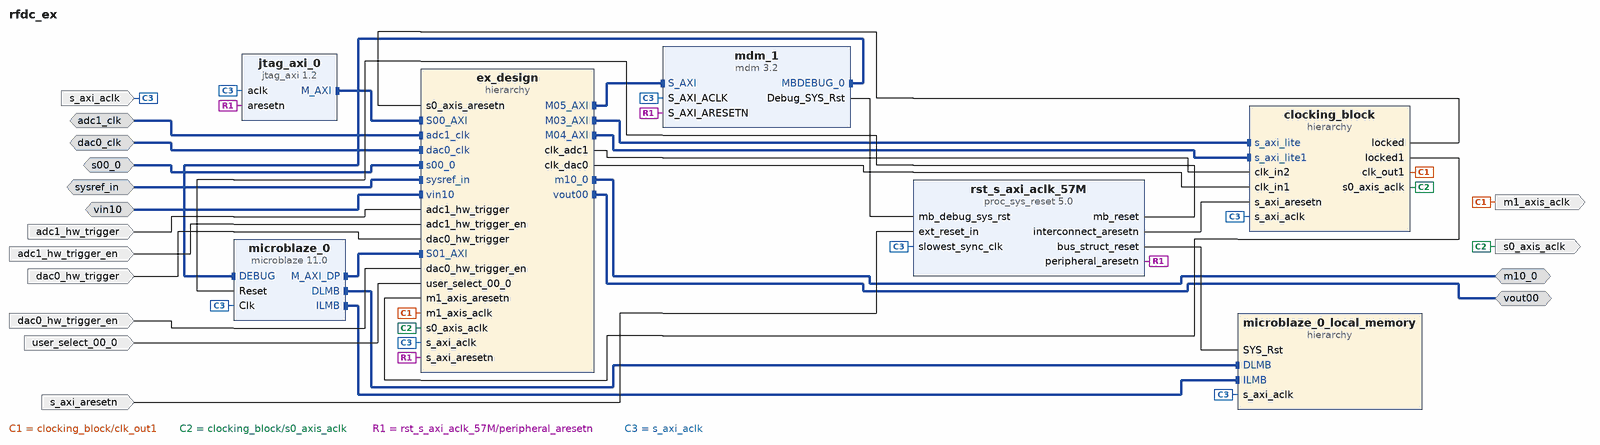
[diagram p0: block diagram of the top level]
# Vivado block design rfdc_ex, xczu67dr-fsve1156-2-i, Vivado 2023.2
create_bd_design rfdc_ex

create_bd_intf_port -mode Slave -vlnv xilinx.com:display_usp_rf_data_converter:diff_pins_rtl:1.0 sysref_in
create_bd_intf_port -mode Slave -vlnv xilinx.com:interface:diff_clock_rtl:1.0 adc1_clk
set_property -dict {CONFIG.FREQ_HZ 250000000} [get_bd_intf_ports adc1_clk]
create_bd_intf_port -mode Slave -vlnv xilinx.com:interface:diff_clock_rtl:1.0 dac0_clk
set_property -dict {CONFIG.FREQ_HZ 400000000} [get_bd_intf_ports dac0_clk]
create_bd_intf_port -mode Slave -vlnv xilinx.com:interface:diff_analog_io_rtl:1.0 vin10
create_bd_intf_port -mode Master -vlnv xilinx.com:interface:diff_analog_io_rtl:1.0 vout00
create_bd_intf_port -mode Master -vlnv xilinx.com:interface:axis_rtl:1.0 m10_0
create_bd_intf_port -mode Slave -vlnv xilinx.com:interface:axis_rtl:1.0 s00_0
set_property -dict [list \
  CONFIG.HAS_TKEEP 0 \
  CONFIG.HAS_TLAST 0 \
  CONFIG.HAS_TREADY 1 \
  CONFIG.HAS_TSTRB 0 \
  CONFIG.LAYERED_METADATA undef \
  CONFIG.TDATA_NUM_BYTES 32 \
  CONFIG.TDEST_WIDTH 0 \
  CONFIG.TID_WIDTH 0 \
  CONFIG.TUSER_WIDTH 0 \
] [get_bd_intf_ports s00_0]
create_bd_port -dir I -type clk s_axi_aclk
set_property -dict {CONFIG.FREQ_HZ 57500000} [get_bd_ports s_axi_aclk]
create_bd_port -dir I -type rst s_axi_aresetn
set_property -dict {CONFIG.POLARITY ACTIVE_LOW} [get_bd_ports s_axi_aresetn]
create_bd_port -dir I adc1_hw_trigger
create_bd_port -dir I adc1_hw_trigger_en
create_bd_port -dir I user_select_00_0
create_bd_port -dir I dac0_hw_trigger
create_bd_port -dir I dac0_hw_trigger_en
create_bd_port -dir O -type clk s0_axis_aclk
set_property -dict {CONFIG.ASSOCIATED_BUSIF s00_0} [get_bd_ports s0_axis_aclk]
create_bd_port -dir O -type clk m1_axis_aclk
set_property -dict {CONFIG.ASSOCIATED_BUSIF m10_0} [get_bd_ports m1_axis_aclk]

create_bd_cell -type hier ex_design
create_bd_cell -type ip -vlnv xilinx.com:ip:jtag_axi:1.2 jtag_axi_0
create_bd_cell -type ip -vlnv xilinx.com:ip:microblaze:11.0 microblaze_0
set_property -dict [list \
  CONFIG.C_DEBUG_ENABLED 1 \
  CONFIG.C_D_AXI 1 \
  CONFIG.C_D_LMB 1 \
  CONFIG.C_I_LMB 1 \
  CONFIG.C_PVR 2 \
  CONFIG.C_PVR_USER1 0x00 \
  CONFIG.C_PVR_USER2 0x00000032 \
  CONFIG.C_USE_STACK_PROTECTION 1 \
] [get_bd_cells microblaze_0]
create_bd_cell -type ip -vlnv xilinx.com:ip:mdm:3.2 mdm_1
set_property -dict [list \
  CONFIG.C_ADDR_SIZE 32 \
  CONFIG.C_DBG_REG_ACCESS 1 \
  CONFIG.C_M_AXI_ADDR_WIDTH 32 \
  CONFIG.C_S_AXI_ADDR_WIDTH 5 \
  CONFIG.C_USE_UART 1 \
] [get_bd_cells mdm_1]
create_bd_cell -type hier microblaze_0_local_memory
create_bd_cell -type ip -vlnv xilinx.com:ip:proc_sys_reset:5.0 rst_s_axi_aclk_57M
create_bd_cell -type hier clocking_block

# ---- hierarchy /ex_design ----
current_bd_instance /ex_design
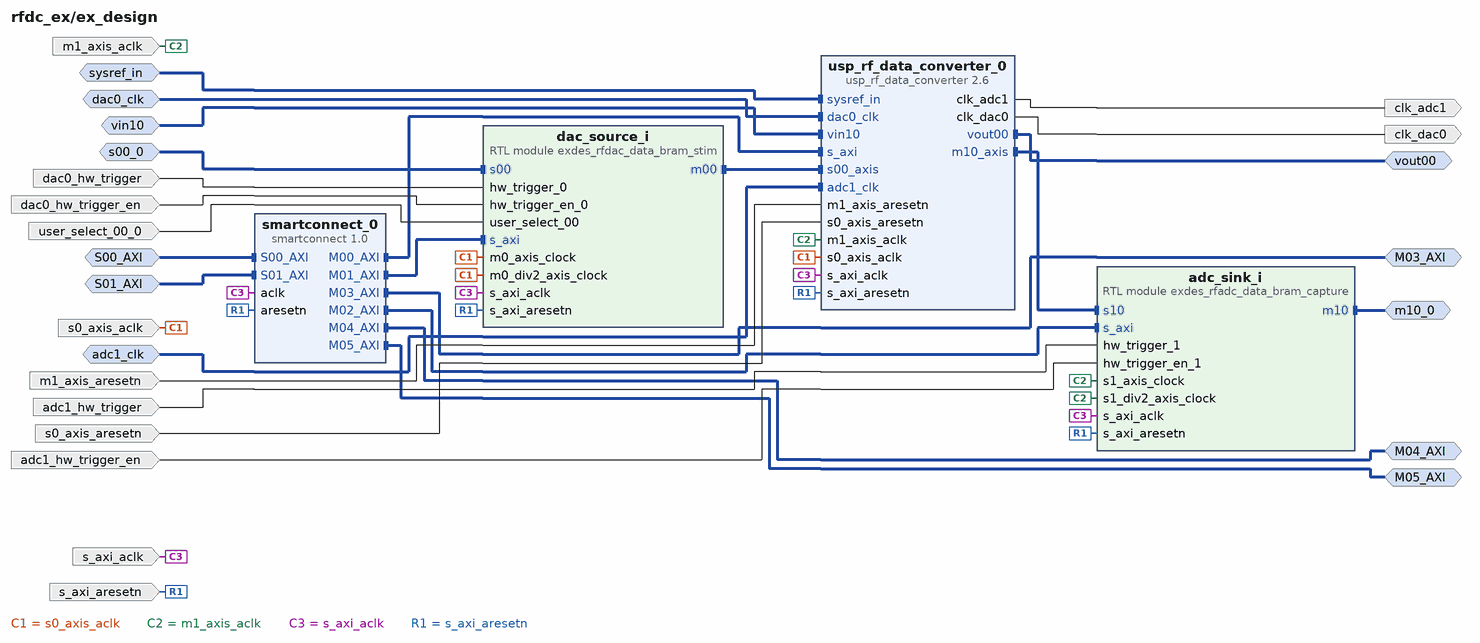
[diagram p1: block diagram inside /ex_design]
create_bd_intf_pin -mode Master -vlnv xilinx.com:interface:axis_rtl:1.0 m10_0
create_bd_intf_pin -mode Slave -vlnv xilinx.com:interface:axis_rtl:1.0 s00_0
create_bd_intf_pin -mode Slave -vlnv xilinx.com:display_usp_rf_data_converter:diff_pins_rtl:1.0 sysref_in
create_bd_intf_pin -mode Slave -vlnv xilinx.com:interface:diff_clock_rtl:1.0 dac0_clk
create_bd_intf_pin -mode Slave -vlnv xilinx.com:interface:diff_analog_io_rtl:1.0 vin10
create_bd_intf_pin -mode Master -vlnv xilinx.com:interface:diff_analog_io_rtl:1.0 vout00
create_bd_intf_pin -mode Slave -vlnv xilinx.com:interface:diff_clock_rtl:1.0 adc1_clk
create_bd_intf_pin -mode Master -vlnv xilinx.com:interface:aximm_rtl:1.0 M03_AXI
create_bd_intf_pin -mode Master -vlnv xilinx.com:interface:aximm_rtl:1.0 M04_AXI
create_bd_intf_pin -mode Slave -vlnv xilinx.com:interface:aximm_rtl:1.0 S00_AXI
create_bd_intf_pin -mode Slave -vlnv xilinx.com:interface:aximm_rtl:1.0 S01_AXI
create_bd_intf_pin -mode Master -vlnv xilinx.com:interface:aximm_rtl:1.0 M05_AXI
create_bd_pin -dir I -type clk s_axi_aclk
create_bd_pin -dir I -type rst s_axi_aresetn
create_bd_pin -dir I adc1_hw_trigger
create_bd_pin -dir I adc1_hw_trigger_en
create_bd_pin -dir I user_select_00_0
create_bd_pin -dir I dac0_hw_trigger_en
create_bd_pin -dir I dac0_hw_trigger
create_bd_pin -dir O -type clk clk_dac0
create_bd_pin -dir I -type clk s0_axis_aclk
create_bd_pin -dir I -type rst s0_axis_aresetn
create_bd_pin -dir O -type clk clk_adc1
create_bd_pin -dir I -type clk m1_axis_aclk
create_bd_pin -dir I -type rst m1_axis_aresetn

create_bd_cell -type ip -vlnv xilinx.com:ip:smartconnect:1.0 smartconnect_0
set_property -dict {CONFIG.NUM_MI 6 CONFIG.NUM_SI 2} [get_bd_cells smartconnect_0]
create_bd_cell -type module -reference exdes_rfadc_data_bram_capture adc_sink_i
set_property -dict [list \
  CONFIG.axi_addr_top 31 \
  CONFIG.mem_size 4194304 \
  CONFIG.use_div2_clk_0 0 \
  CONFIG.use_div2_clk_1 0 \
  CONFIG.use_div2_clk_2 0 \
  CONFIG.use_div2_clk_3 0 \
] [get_bd_cells adc_sink_i]
create_bd_cell -type module -reference exdes_rfdac_data_bram_stim dac_source_i
set_property -dict [list \
  CONFIG.axi_addr_top 31 \
  CONFIG.mem_size 4194304 \
  CONFIG.use_div2_clk_0 0 \
  CONFIG.use_div2_clk_1 0 \
  CONFIG.use_div2_clk_2 0 \
  CONFIG.use_div2_clk_3 0 \
] [get_bd_cells dac_source_i]
create_bd_cell -type ip -vlnv xilinx.com:ip:usp_rf_data_converter:2.6 usp_rf_data_converter_0
set_property -dict [list \
  CONFIG.ADC0_Band 0 \
  CONFIG.ADC1_Band 0 \
  CONFIG.ADC1_Clock_Dist 0 \
  CONFIG.ADC1_Clock_Source 1 \
  CONFIG.ADC1_Link_Coupling 0 \
  CONFIG.ADC1_Outclk_Freq 31.250 \
  CONFIG.ADC1_PLL_Enable true \
  CONFIG.ADC1_Refclk_Div 1 \
  CONFIG.ADC1_Refclk_Freq 400.000 \
  CONFIG.ADC1_Sampling_Rate 2.0 \
  CONFIG.ADC224_En false \
  CONFIG.ADC225_En false \
  CONFIG.ADC226_En false \
  CONFIG.ADC227_En false \
  CONFIG.ADC2_Band 0 \
  CONFIG.ADC3_Band 0 \
  CONFIG.ADC_CalOpt_Mode10 1 \
  CONFIG.ADC_Coarse_Mixer_Freq10 3 \
  CONFIG.ADC_DSA_RTS false \
  CONFIG.ADC_Data_Type10 0 \
  CONFIG.ADC_Data_Width10 8 \
  CONFIG.ADC_Debug false \
  CONFIG.ADC_Decimation_Mode10 8 \
  CONFIG.ADC_Dither10 true \
  CONFIG.ADC_Mixer_Mode10 2 \
  CONFIG.ADC_Mixer_Type10 1 \
  CONFIG.ADC_Nyquist10 1 \
  CONFIG.ADC_OBS10 false \
  CONFIG.ADC_RTS false \
  CONFIG.ADC_Slice00_Enable false \
  CONFIG.ADC_Slice01_Enable false \
  CONFIG.ADC_Slice02_Enable false \
  CONFIG.ADC_Slice03_Enable false \
  CONFIG.ADC_Slice10_Enable true \
  CONFIG.ADC_Slice11_Enable false \
  CONFIG.ADC_Slice12_Enable false \
  CONFIG.ADC_Slice13_Enable false \
  CONFIG.ADC_Slice20_Enable false \
  CONFIG.ADC_Slice22_Enable false \
  CONFIG.ADC_TDD_RTS10 0 \
  CONFIG.AMS_Factory_Var 0 \
  CONFIG.Analog_Detection 1 \
  CONFIG.Axiclk_Freq 57.5 \
  CONFIG.Calibration_Freeze false \
  CONFIG.Calibration_Time 10 \
  CONFIG.Clock_Forwarding false \
  CONFIG.DAC0_Band 0 \
  CONFIG.DAC0_Clock_Dist 0 \
  CONFIG.DAC0_Clock_Source 3 \
  CONFIG.DAC0_Link_Coupling 0 \
  CONFIG.DAC0_Multi_Tile_Sync false \
  CONFIG.DAC0_Outclk_Freq 50.000 \
  CONFIG.DAC0_PLL_Enable true \
  CONFIG.DAC0_Refclk_Div 1 \
  CONFIG.DAC0_Refclk_Freq 400.000 \
  CONFIG.DAC0_Sampling_Rate 6.4 \
  CONFIG.DAC0_VOP 20.0 \
  CONFIG.DAC1_Band 0 \
  CONFIG.DAC228_En false \
  CONFIG.DAC229_En false \
  CONFIG.DAC230_En false \
  CONFIG.DAC231_En false \
  CONFIG.DAC2_Band 0 \
  CONFIG.DAC3_Band 0 \
  CONFIG.DAC_Data_Type00 0 \
  CONFIG.DAC_Data_Width00 16 \
  CONFIG.DAC_Debug false \
  CONFIG.DAC_Decoder_Mode00 0 \
  CONFIG.DAC_Interpolation_Mode00 8 \
  CONFIG.DAC_Invsinc_Ctrl00 false \
  CONFIG.DAC_Mixer_Mode00 0 \
  CONFIG.DAC_Mixer_Type00 2 \
  CONFIG.DAC_Mode00 0 \
  CONFIG.DAC_NCO_Freq00 4.5 \
  CONFIG.DAC_NCO_Phase00 0 \
  CONFIG.DAC_NCO_RTS false \
  CONFIG.DAC_Neg_Quadrature00 false \
  CONFIG.DAC_Nyquist00 1 \
  CONFIG.DAC_RTS false \
  CONFIG.DAC_Slice00_Enable true \
  CONFIG.DAC_Slice01_Enable false \
  CONFIG.DAC_Slice02_Enable false \
  CONFIG.DAC_Slice03_Enable false \
  CONFIG.DAC_Slice10_Enable false \
  CONFIG.DAC_Slice11_Enable false \
  CONFIG.DAC_Slice12_Enable false \
  CONFIG.DAC_Slice13_Enable false \
  CONFIG.DAC_TDD_RTS00 0 \
  CONFIG.DAC_VOP_Mode 1 \
  CONFIG.DAC_VOP_RTS false \
  CONFIG.PRESET None \
  CONFIG.RESERVED_3 110000 \
  CONFIG.RF_Analyzer 1 \
  CONFIG.VNC_Include_Fs2_Change true \
  CONFIG.VNC_Include_OIS_Change true \
  CONFIG.VNC_Testing false \
  CONFIG.disable_bg_cal_en 1 \
  CONFIG.mADC_Band 0 \
  CONFIG.mDAC_Band 0 \
  CONFIG.mDAC_Slice00_Enable false \
  CONFIG.mDAC_Slice01_Enable false \
  CONFIG.mDAC_Slice02_Enable false \
  CONFIG.mDAC_Slice03_Enable false \
  CONFIG.mDAC_VOP 20.0 \
  CONFIG.production_simulation 0 \
  CONFIG.tb_adc_fft true \
  CONFIG.tb_dac_fft true \
  CONFIG.use_bram 1 \
] [get_bd_cells usp_rf_data_converter_0]

# ---- hierarchy /microblaze_0_local_memory ----
current_bd_instance /microblaze_0_local_memory
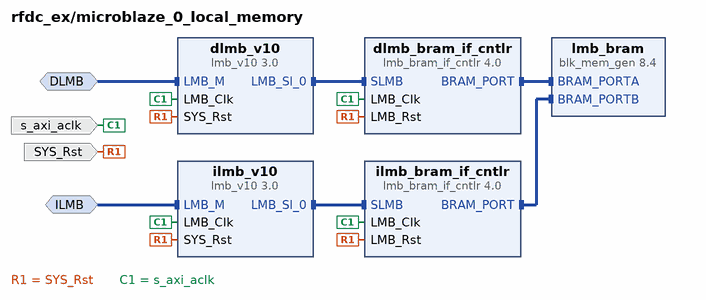
[diagram p2: block diagram inside /microblaze_0_local_memory]
create_bd_intf_pin -mode MirroredMaster -vlnv xilinx.com:interface:lmb_rtl:1.0 DLMB
create_bd_intf_pin -mode MirroredMaster -vlnv xilinx.com:interface:lmb_rtl:1.0 ILMB
create_bd_pin -dir I -type rst SYS_Rst
create_bd_pin -dir I -type clk s_axi_aclk

create_bd_cell -type ip -vlnv xilinx.com:ip:lmb_bram_if_cntlr:4.0 dlmb_bram_if_cntlr
set_property -dict {CONFIG.C_ECC 0} [get_bd_cells dlmb_bram_if_cntlr]
create_bd_cell -type ip -vlnv xilinx.com:ip:lmb_v10:3.0 dlmb_v10
create_bd_cell -type ip -vlnv xilinx.com:ip:lmb_bram_if_cntlr:4.0 ilmb_bram_if_cntlr
set_property -dict {CONFIG.C_ECC 0} [get_bd_cells ilmb_bram_if_cntlr]
create_bd_cell -type ip -vlnv xilinx.com:ip:lmb_v10:3.0 ilmb_v10
create_bd_cell -type ip -vlnv xilinx.com:ip:blk_mem_gen:8.4 lmb_bram
set_property -dict {CONFIG.Memory_Type True_Dual_Port_RAM CONFIG.use_bram_block BRAM_Controller} [get_bd_cells lmb_bram]

# ---- hierarchy /clocking_block ----
current_bd_instance /clocking_block
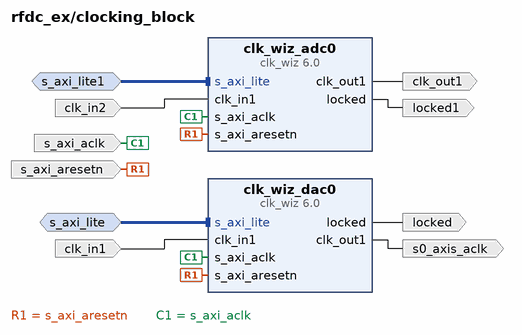
[diagram p3: block diagram inside /clocking_block]
create_bd_intf_pin -mode Slave -vlnv xilinx.com:interface:aximm_rtl:1.0 s_axi_lite
create_bd_intf_pin -mode Slave -vlnv xilinx.com:interface:aximm_rtl:1.0 s_axi_lite1
create_bd_pin -dir I -type clk s_axi_aclk
create_bd_pin -dir I -type rst s_axi_aresetn
create_bd_pin -dir I -type clk clk_in1
create_bd_pin -dir O -type clk s0_axis_aclk
create_bd_pin -dir O locked
create_bd_pin -dir O locked1
create_bd_pin -dir I -type clk clk_in2
create_bd_pin -dir O -type clk clk_out1

create_bd_cell -type ip -vlnv xilinx.com:ip:clk_wiz:6.0 clk_wiz_dac0
set_property -dict [list \
  CONFIG.AXI_DRP false \
  CONFIG.CLKOUT1_DRIVES BUFG \
  CONFIG.CLKOUT1_REQUESTED_OUT_FREQ 50.000 \
  CONFIG.FEEDBACK_SOURCE FDBK_AUTO \
  CONFIG.PRIM_IN_FREQ 50.000 \
  CONFIG.PRIM_SOURCE No_buffer \
  CONFIG.USE_DYN_RECONFIG true \
  CONFIG.USE_PHASE_ALIGNMENT true \
] [get_bd_cells clk_wiz_dac0]
create_bd_cell -type ip -vlnv xilinx.com:ip:clk_wiz:6.0 clk_wiz_adc0
set_property -dict [list \
  CONFIG.AXI_DRP false \
  CONFIG.CLKOUT1_DRIVES BUFG \
  CONFIG.CLKOUT1_REQUESTED_OUT_FREQ 31.250 \
  CONFIG.FEEDBACK_SOURCE FDBK_AUTO \
  CONFIG.PRIM_IN_FREQ 31.250 \
  CONFIG.PRIM_SOURCE No_buffer \
  CONFIG.USE_DYN_RECONFIG true \
  CONFIG.USE_PHASE_ALIGNMENT true \
] [get_bd_cells clk_wiz_adc0]

# ---- connections ----

current_bd_instance /ex_design
connect_bd_intf_net [get_bd_intf_pins usp_rf_data_converter_0/sysref_in] [get_bd_intf_pins sysref_in]
connect_bd_intf_net [get_bd_intf_pins adc_sink_i/m10] [get_bd_intf_pins m10_0]
connect_bd_intf_net [get_bd_intf_pins usp_rf_data_converter_0/dac0_clk] [get_bd_intf_pins dac0_clk]
connect_bd_intf_net [get_bd_intf_pins dac_source_i/s00] [get_bd_intf_pins s00_0]
connect_bd_intf_net [get_bd_intf_pins usp_rf_data_converter_0/vin10] [get_bd_intf_pins vin10]
connect_bd_intf_net [get_bd_intf_pins usp_rf_data_converter_0/vout00] [get_bd_intf_pins vout00]
connect_bd_intf_net [get_bd_intf_pins usp_rf_data_converter_0/adc1_clk] [get_bd_intf_pins adc1_clk]
connect_bd_intf_net [get_bd_intf_pins smartconnect_0/M03_AXI] [get_bd_intf_pins M03_AXI]
connect_bd_intf_net [get_bd_intf_pins smartconnect_0/M04_AXI] [get_bd_intf_pins M04_AXI]
connect_bd_intf_net [get_bd_intf_pins smartconnect_0/S00_AXI] [get_bd_intf_pins S00_AXI]
connect_bd_intf_net [get_bd_intf_pins smartconnect_0/S01_AXI] [get_bd_intf_pins S01_AXI]
connect_bd_intf_net [get_bd_intf_pins smartconnect_0/M05_AXI] [get_bd_intf_pins M05_AXI]
connect_bd_intf_net [get_bd_intf_pins dac_source_i/m00] [get_bd_intf_pins usp_rf_data_converter_0/s00_axis]
connect_bd_intf_net [get_bd_intf_pins smartconnect_0/M00_AXI] [get_bd_intf_pins usp_rf_data_converter_0/s_axi]
connect_bd_intf_net [get_bd_intf_pins smartconnect_0/M01_AXI] [get_bd_intf_pins dac_source_i/s_axi]
connect_bd_intf_net [get_bd_intf_pins smartconnect_0/M02_AXI] [get_bd_intf_pins adc_sink_i/s_axi]
connect_bd_intf_net [get_bd_intf_pins usp_rf_data_converter_0/m10_axis] [get_bd_intf_pins adc_sink_i/s10]
connect_bd_net [get_bd_pins s0_axis_aclk] \
  [get_bd_pins dac_source_i/m0_axis_clock] [get_bd_pins usp_rf_data_converter_0/s0_axis_aclk] \
  [get_bd_pins dac_source_i/m0_div2_axis_clock]
connect_bd_net [get_bd_pins m1_axis_aclk] \
  [get_bd_pins adc_sink_i/s1_axis_clock] [get_bd_pins usp_rf_data_converter_0/m1_axis_aclk] \
  [get_bd_pins adc_sink_i/s1_div2_axis_clock]
connect_bd_net [get_bd_pins adc1_hw_trigger] [get_bd_pins adc_sink_i/hw_trigger_1]
connect_bd_net [get_bd_pins adc1_hw_trigger_en] [get_bd_pins adc_sink_i/hw_trigger_en_1]
connect_bd_net [get_bd_pins dac0_hw_trigger] [get_bd_pins dac_source_i/hw_trigger_0]
connect_bd_net [get_bd_pins dac0_hw_trigger_en] [get_bd_pins dac_source_i/hw_trigger_en_0]
connect_bd_net [get_bd_pins m1_axis_aresetn] [get_bd_pins usp_rf_data_converter_0/m1_axis_aresetn]
connect_bd_net [get_bd_pins s0_axis_aresetn] [get_bd_pins usp_rf_data_converter_0/s0_axis_aresetn]
connect_bd_net [get_bd_pins s_axi_aclk] \
  [get_bd_pins smartconnect_0/aclk] [get_bd_pins adc_sink_i/s_axi_aclk] [get_bd_pins dac_source_i/s_axi_aclk] \
  [get_bd_pins usp_rf_data_converter_0/s_axi_aclk]
connect_bd_net [get_bd_pins s_axi_aresetn] \
  [get_bd_pins smartconnect_0/aresetn] [get_bd_pins adc_sink_i/s_axi_aresetn] [get_bd_pins dac_source_i/s_axi_aresetn] \
  [get_bd_pins usp_rf_data_converter_0/s_axi_aresetn]
connect_bd_net -net user_select_00_0_1 [get_bd_pins user_select_00_0] [get_bd_pins dac_source_i/user_select_00]
connect_bd_net [get_bd_pins usp_rf_data_converter_0/clk_adc1] [get_bd_pins clk_adc1]
connect_bd_net [get_bd_pins usp_rf_data_converter_0/clk_dac0] [get_bd_pins clk_dac0]

current_bd_instance /microblaze_0_local_memory
connect_bd_intf_net -intf_net microblaze_0_dlmb [get_bd_intf_pins DLMB] [get_bd_intf_pins dlmb_v10/LMB_M]
connect_bd_intf_net -intf_net microblaze_0_dlmb_bus [get_bd_intf_pins dlmb_bram_if_cntlr/SLMB] [get_bd_intf_pins dlmb_v10/LMB_Sl_0]
connect_bd_intf_net -intf_net microblaze_0_dlmb_cntlr [get_bd_intf_pins dlmb_bram_if_cntlr/BRAM_PORT] [get_bd_intf_pins lmb_bram/BRAM_PORTA]
connect_bd_intf_net -intf_net microblaze_0_ilmb [get_bd_intf_pins ILMB] [get_bd_intf_pins ilmb_v10/LMB_M]
connect_bd_intf_net -intf_net microblaze_0_ilmb_bus [get_bd_intf_pins ilmb_bram_if_cntlr/SLMB] [get_bd_intf_pins ilmb_v10/LMB_Sl_0]
connect_bd_intf_net -intf_net microblaze_0_ilmb_cntlr [get_bd_intf_pins ilmb_bram_if_cntlr/BRAM_PORT] [get_bd_intf_pins lmb_bram/BRAM_PORTB]
connect_bd_net [get_bd_pins SYS_Rst] \
  [get_bd_pins dlmb_bram_if_cntlr/LMB_Rst] [get_bd_pins dlmb_v10/SYS_Rst] [get_bd_pins ilmb_bram_if_cntlr/LMB_Rst] \
  [get_bd_pins ilmb_v10/SYS_Rst]
connect_bd_net [get_bd_pins s_axi_aclk] \
  [get_bd_pins dlmb_bram_if_cntlr/LMB_Clk] [get_bd_pins dlmb_v10/LMB_Clk] [get_bd_pins ilmb_bram_if_cntlr/LMB_Clk] \
  [get_bd_pins ilmb_v10/LMB_Clk]
set_property HDL_ATTRIBUTE.BMM_INFO_ADDRESS_SPACE {byte  0x00000000 32 > rfdc_ex microblaze_0_local_memory/lmb_bram} [get_bd_cells dlmb_bram_if_cntlr]
set_property HDL_ATTRIBUTE.KEEP_HIERARCHY yes [get_bd_cells dlmb_bram_if_cntlr]

current_bd_instance /clocking_block
connect_bd_intf_net [get_bd_intf_pins clk_wiz_adc0/s_axi_lite] [get_bd_intf_pins s_axi_lite1]
connect_bd_intf_net -intf_net ex_design_M03_AXI [get_bd_intf_pins s_axi_lite] [get_bd_intf_pins clk_wiz_dac0/s_axi_lite]
connect_bd_net -net clk_in2_1 [get_bd_pins clk_in2] [get_bd_pins clk_wiz_adc0/clk_in1]
connect_bd_net [get_bd_pins clk_wiz_adc0/clk_out1] [get_bd_pins clk_out1]
connect_bd_net [get_bd_pins clk_wiz_adc0/locked] [get_bd_pins locked1]
connect_bd_net [get_bd_pins clk_wiz_dac0/clk_out1] [get_bd_pins s0_axis_aclk]
connect_bd_net [get_bd_pins clk_wiz_dac0/locked] [get_bd_pins locked]
connect_bd_net -net ex_design_clk_dac0 [get_bd_pins clk_in1] [get_bd_pins clk_wiz_dac0/clk_in1]
connect_bd_net -net rst_s_axi_aclk_57M_interconnect_aresetn [get_bd_pins s_axi_aresetn] \
  [get_bd_pins clk_wiz_dac0/s_axi_aresetn] [get_bd_pins clk_wiz_adc0/s_axi_aresetn]
connect_bd_net [get_bd_pins s_axi_aclk] [get_bd_pins clk_wiz_dac0/s_axi_aclk] [get_bd_pins clk_wiz_adc0/s_axi_aclk]

current_bd_instance /
connect_bd_intf_net [get_bd_intf_ports adc1_clk] [get_bd_intf_pins ex_design/adc1_clk]
connect_bd_intf_net [get_bd_intf_ports dac0_clk] [get_bd_intf_pins ex_design/dac0_clk]
connect_bd_intf_net [get_bd_intf_pins clocking_block/s_axi_lite] [get_bd_intf_pins ex_design/M03_AXI]
connect_bd_intf_net [get_bd_intf_pins ex_design/M04_AXI] [get_bd_intf_pins clocking_block/s_axi_lite1]
connect_bd_intf_net [get_bd_intf_pins mdm_1/S_AXI] [get_bd_intf_pins ex_design/M05_AXI]
connect_bd_intf_net [get_bd_intf_ports m10_0] [get_bd_intf_pins ex_design/m10_0]
connect_bd_intf_net [get_bd_intf_ports vout00] [get_bd_intf_pins ex_design/vout00]
connect_bd_intf_net [get_bd_intf_pins jtag_axi_0/M_AXI] [get_bd_intf_pins ex_design/S00_AXI]
connect_bd_intf_net [get_bd_intf_pins microblaze_0/M_AXI_DP] [get_bd_intf_pins ex_design/S01_AXI]
connect_bd_intf_net [get_bd_intf_pins mdm_1/MBDEBUG_0] [get_bd_intf_pins microblaze_0/DEBUG]
connect_bd_intf_net [get_bd_intf_pins microblaze_0/DLMB] [get_bd_intf_pins microblaze_0_local_memory/DLMB]
connect_bd_intf_net [get_bd_intf_pins microblaze_0/ILMB] [get_bd_intf_pins microblaze_0_local_memory/ILMB]
connect_bd_intf_net -intf_net s00_0_1 [get_bd_intf_ports s00_0] [get_bd_intf_pins ex_design/s00_0]
connect_bd_intf_net [get_bd_intf_ports sysref_in] [get_bd_intf_pins ex_design/sysref_in]
connect_bd_intf_net -intf_net vin10_1 [get_bd_intf_ports vin10] [get_bd_intf_pins ex_design/vin10]
connect_bd_net [get_bd_ports adc1_hw_trigger] [get_bd_pins ex_design/adc1_hw_trigger]
connect_bd_net [get_bd_ports adc1_hw_trigger_en] [get_bd_pins ex_design/adc1_hw_trigger_en]
connect_bd_net -net clk_wiz_adc0_clk_out1 [get_bd_pins clocking_block/clk_out1] [get_bd_pins ex_design/m1_axis_aclk] [get_bd_ports m1_axis_aclk]
connect_bd_net -net clk_wiz_dac0_clk_out1 [get_bd_pins clocking_block/s0_axis_aclk] [get_bd_pins ex_design/s0_axis_aclk] [get_bd_ports s0_axis_aclk]
connect_bd_net -net clk_wiz_dac0_locked [get_bd_pins clocking_block/locked] [get_bd_pins ex_design/s0_axis_aresetn]
connect_bd_net [get_bd_ports dac0_hw_trigger] [get_bd_pins ex_design/dac0_hw_trigger]
connect_bd_net [get_bd_ports dac0_hw_trigger_en] [get_bd_pins ex_design/dac0_hw_trigger_en]
connect_bd_net [get_bd_pins ex_design/clk_adc1] [get_bd_pins clocking_block/clk_in2]
connect_bd_net [get_bd_pins ex_design/clk_dac0] [get_bd_pins clocking_block/clk_in1]
connect_bd_net -net m1_axis_aresetn_1 [get_bd_pins clocking_block/locked1] [get_bd_pins ex_design/m1_axis_aresetn]
connect_bd_net [get_bd_pins mdm_1/Debug_SYS_Rst] [get_bd_pins rst_s_axi_aclk_57M/mb_debug_sys_rst]
connect_bd_net [get_bd_pins rst_s_axi_aclk_57M/bus_struct_reset] [get_bd_pins microblaze_0_local_memory/SYS_Rst]
connect_bd_net [get_bd_pins rst_s_axi_aclk_57M/interconnect_aresetn] [get_bd_pins clocking_block/s_axi_aresetn]
connect_bd_net [get_bd_pins rst_s_axi_aclk_57M/mb_reset] [get_bd_pins microblaze_0/Reset]
connect_bd_net [get_bd_pins rst_s_axi_aclk_57M/peripheral_aresetn] \
  [get_bd_pins jtag_axi_0/aresetn] [get_bd_pins ex_design/s_axi_aresetn] [get_bd_pins mdm_1/S_AXI_ARESETN]
connect_bd_net [get_bd_ports s_axi_aclk] \
  [get_bd_pins ex_design/s_axi_aclk] [get_bd_pins microblaze_0/Clk] [get_bd_pins microblaze_0_local_memory/s_axi_aclk] \
  [get_bd_pins rst_s_axi_aclk_57M/slowest_sync_clk] [get_bd_pins jtag_axi_0/aclk] [get_bd_pins mdm_1/S_AXI_ACLK] \
  [get_bd_pins clocking_block/s_axi_aclk]
connect_bd_net [get_bd_ports s_axi_aresetn] [get_bd_pins rst_s_axi_aclk_57M/ext_reset_in]
connect_bd_net -net user_select_00_0_1 [get_bd_ports user_select_00_0] [get_bd_pins ex_design/user_select_00_0]
set_property HDL_ATTRIBUTE.BMM_INFO_PROCESSOR {microblaze-le > rfdc_ex microblaze_0_local_memory/dlmb_bram_if_cntlr} [get_bd_cells microblaze_0]
set_property HDL_ATTRIBUTE.KEEP_HIERARCHY yes [get_bd_cells microblaze_0]

# ---- address map ----
assign_bd_address -offset 0x41400000 -range 4K -target_address_space [get_bd_addr_spaces jtag_axi_0/Data] [get_bd_addr_segs mdm_1/S_AXI/Reg]
assign_bd_address -offset 0x44B00000 -range 256K -target_address_space [get_bd_addr_spaces jtag_axi_0/Data] [get_bd_addr_segs ex_design/usp_rf_data_converter_0/s_axi/Reg]
assign_bd_address -offset 0x44C00000 -range 64K -target_address_space [get_bd_addr_spaces jtag_axi_0/Data] [get_bd_addr_segs clocking_block/clk_wiz_dac0/s_axi_lite/Reg]
assign_bd_address -offset 0x44C50000 -range 64K -target_address_space [get_bd_addr_spaces jtag_axi_0/Data] [get_bd_addr_segs clocking_block/clk_wiz_adc0/s_axi_lite/Reg]
assign_bd_address -offset 0xC0000000 -range 2M -target_address_space [get_bd_addr_spaces jtag_axi_0/Data] [get_bd_addr_segs ex_design/dac_source_i/s_axi/reg0]
assign_bd_address -offset 0xE0000000 -range 2M -target_address_space [get_bd_addr_spaces jtag_axi_0/Data] [get_bd_addr_segs ex_design/adc_sink_i/s_axi/reg0]
assign_bd_address -offset 0x00000000 -range 512K -target_address_space [get_bd_addr_spaces microblaze_0/Data] [get_bd_addr_segs microblaze_0_local_memory/dlmb_bram_if_cntlr/SLMB/Mem]
assign_bd_address -offset 0x41400000 -range 4K -target_address_space [get_bd_addr_spaces microblaze_0/Data] [get_bd_addr_segs mdm_1/S_AXI/Reg]
assign_bd_address -offset 0x44B00000 -range 256K -target_address_space [get_bd_addr_spaces microblaze_0/Data] [get_bd_addr_segs ex_design/usp_rf_data_converter_0/s_axi/Reg]
assign_bd_address -offset 0x44C00000 -range 64K -target_address_space [get_bd_addr_spaces microblaze_0/Data] [get_bd_addr_segs clocking_block/clk_wiz_dac0/s_axi_lite/Reg]
assign_bd_address -offset 0x44C50000 -range 64K -target_address_space [get_bd_addr_spaces microblaze_0/Data] [get_bd_addr_segs clocking_block/clk_wiz_adc0/s_axi_lite/Reg]
assign_bd_address -offset 0xC0000000 -range 2M -target_address_space [get_bd_addr_spaces microblaze_0/Data] [get_bd_addr_segs ex_design/dac_source_i/s_axi/reg0]
assign_bd_address -offset 0xE0000000 -range 2M -target_address_space [get_bd_addr_spaces microblaze_0/Data] [get_bd_addr_segs ex_design/adc_sink_i/s_axi/reg0]
assign_bd_address -offset 0x00000000 -range 512K -target_address_space [get_bd_addr_spaces microblaze_0/Instruction] [get_bd_addr_segs microblaze_0_local_memory/ilmb_bram_if_cntlr/SLMB/Mem]

validate_bd_design
save_bd_design
